# Altium schematic sheet AVR-MEM-CLPD.SchDoc
size A4; Organization: Altium Limited; Address1: L3, 12a Rodborough Rd; Address2: Frenchs Forest; Address3: NSW; Address4: Australia 2086; DocumentName: Farb Borg - ICS
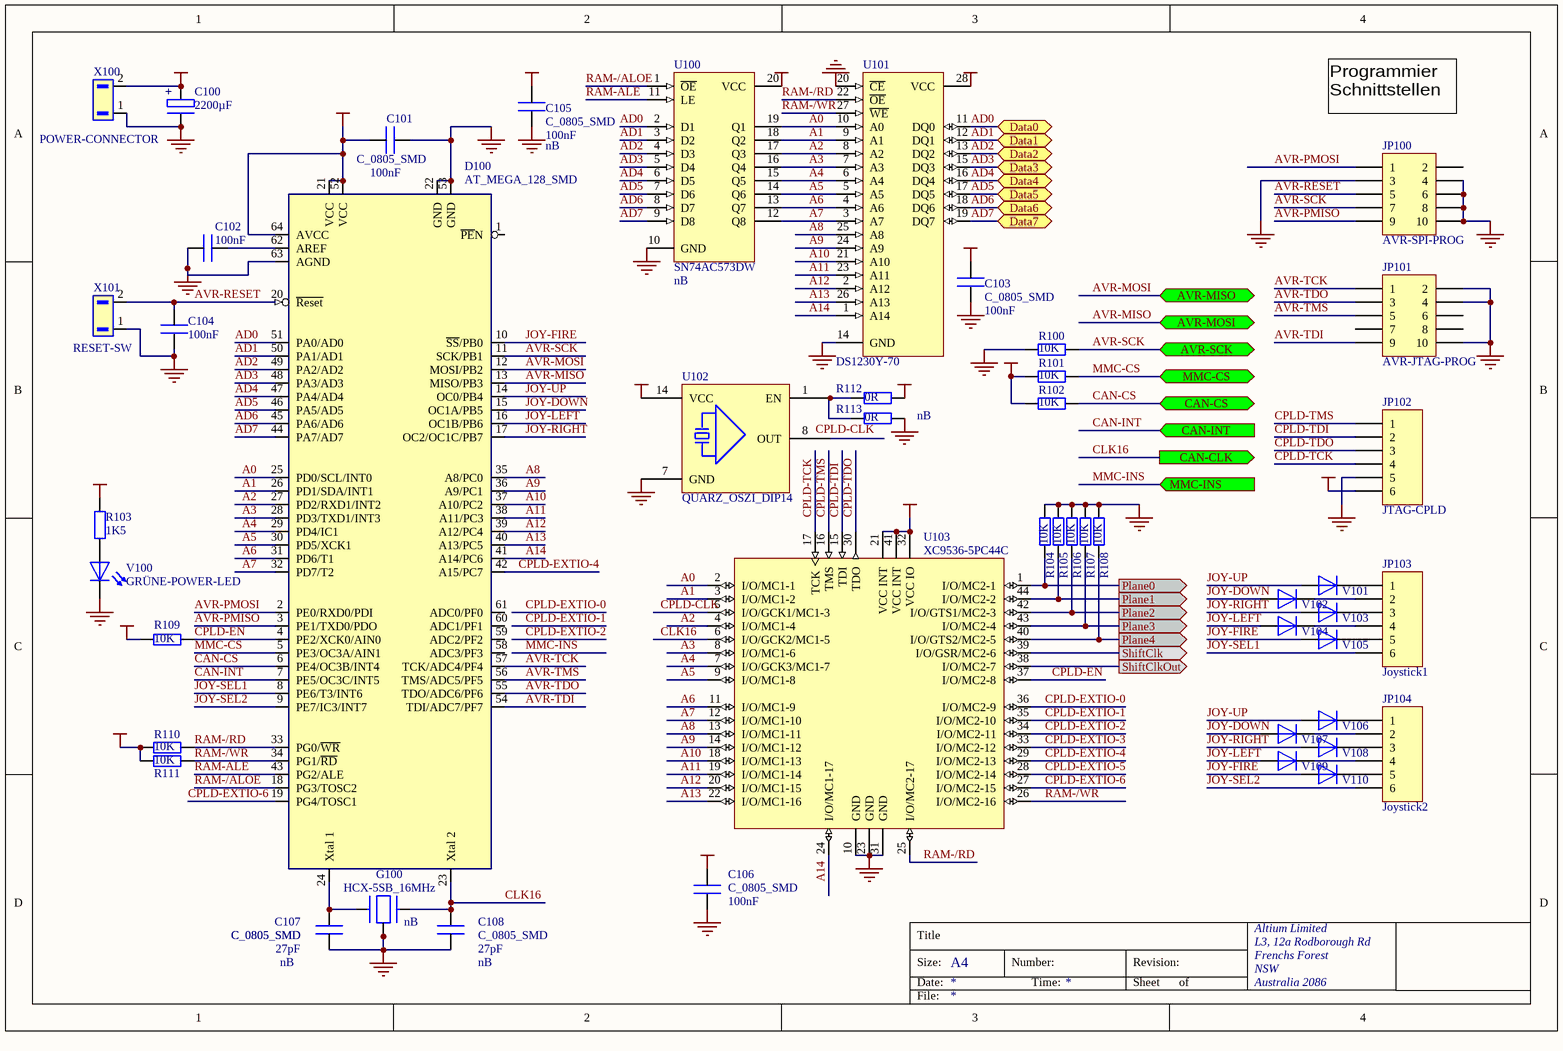
[diagram p0: AVR-MEM-CLPD.SchDoc]

## Parts
C100  C_ELKO_10  [CE_10_21]  (value not drawn)
C101  C_0805_SMD  [0805_R]
C102  C_0805_SMD  [0805_R]  (value not drawn)
C103  C_0805_SMD  [0805_R]
C104  C_0805_SMD  [0805_R]  (value not drawn)
C105  C_0805_SMD  [0805_R]
C106  C_0805_SMD  [0805_R]
C107  C_0805_SMD  [0805_R]
C108  C_0805_SMD  [0805_R]
D100  AT_MEGA_128_SMD  [TQFP64]
G100  HCX-5SB_16MHz  [HCX-5SB_R]
JP100  AVR-SPI-PROG  [HDR2X5]
JP101  AVR-JTAG-PROG  [HDR2X5]
JP102  JTAG-CPLD  [HDR1X6]
JP103  Joystick1  [HDR1X6]
JP104  Joystick2  [HDR1X6]
R100  value 10K  [CR2012-0805]  (hidden comment: PullUp)
R101  value 10K  [CR2012-0805]  (hidden comment: PullUp)
R102  value 10K  [CR2012-0805]  (hidden comment: PullUp)
R103  value 1K5  [CR2012-0805]  (hidden comment: PullUp)
R104  value 10K  [CR2012-0805]  (hidden comment: PullUp)
R105  value 10K  [CR2012-0805]  (hidden comment: PullUp)
R106  value 10K  [CR2012-0805]  (hidden comment: PullUp)
R107  value 10K  [CR2012-0805]  (hidden comment: PullUp)
R108  value 10K  [CR2012-0805]  (hidden comment: PullUp)
R109  value 10K  [CR2012-0805]  (hidden comment: PullUp)
R110  value 10K  [CR2012-0805]  (hidden comment: PullUp)
R111  value 10K  [CR2012-0805]  (hidden comment: PullUp)
R112  value 0R  [CR2012-0805]  (hidden comment: PullUp)
R113  value 0R  [CR2012-0805]  (hidden comment: PullUp)
U100  SN74AC573DW  [DW020]
U101  DS1230Y-70  [ENDIP28A]
U102  QUARZ_OSZI_DIP14  [DIP-14]
U103  XC9536-5PC44C  [PC44]
V100  GRÜNE-POWER-LED  [0805_R]
V101  DIODE_0805_SMD  [0805_R]  (value not drawn)
V102  DIODE_0805_SMD  [0805_R]  (value not drawn)
V103  DIODE_0805_SMD  [0805_R]  (value not drawn)
V104  DIODE_0805_SMD  [0805_R]  (value not drawn)
V105  DIODE_0805_SMD  [0805_R]  (value not drawn)
V106  DIODE_0805_SMD  [0805_R]  (value not drawn)
V107  DIODE_0805_SMD  [0805_R]  (value not drawn)
V108  DIODE_0805_SMD  [0805_R]  (value not drawn)
V109  DIODE_0805_SMD  [0805_R]  (value not drawn)
V110  DIODE_0805_SMD  [0805_R]  (value not drawn)
X100  POWER-CONNECTOR  [STL(Z)1550/2G-3,5-H]
X101  RESET-SW  [STL(Z)1550/2G-3,5-H]

## Ports
AVR-MISO (bidir), AVR-MOSI (bidir), AVR-SCK (bidir), CAN-CLK (out), CAN-CS (bidir), CAN-INT (in), Data0 (bidir), Data1 (bidir), Data2 (bidir), Data3 (bidir), Data4 (bidir), Data5 (bidir), Data6 (bidir), Data7 (bidir), MMC-CS (bidir), MMC-INS (in), Plane0 (out), Plane1 (out), Plane2 (out), Plane3 (out), Plane4 (out), ShiftClk (out), ShiftClkOut (out)

## Nets
GND: C100.2 C101.1 C102.2 C103.1 C104.1 C105.1 C106.1 C107.2 C108.2 D100.22(GND) D100.53(GND) D100.63(AGND) G100.2 G100.4 JP100.3 JP100.4 JP100.6 JP100.8 JP100.10 JP101.2 JP101.4 JP101.10 JP102.5 R100.2 R104.1 R105.1 R106.1 R107.1 R108.1 R113.1 U100.10(GND) U101.14(GND) U101.20(~{CE}) U102.7(GND) U103.10(GND) U103.23(GND) U103.31(GND) V100.2(K) X100.1 X101.1
VCC: C100.1 C101.2 C103.2 C105.2 C106.2 D100.21(VCC) D100.52(VCC) D100.64(AVCC) JP102.6 R101.2 R102.2 R103.1 R109.2 R110.2 R111.2 R112.1 U100.20(VCC) U101.28(VCC) U102.14(VCC) U103.21(VCC_INT) U103.32(VCC_IO) U103.41(VCC_INT) X100.2
A0: D100.25(PD0/SCL/INT0) U100.19(Q1) U101.10(A0) U103.2(I/O/MC1-1)
A1: D100.26(PD1/SDA/INT1) U100.18(Q2) U101.9(A1) U103.3(I/O/MC1-2)
A2: D100.27(PD2/RXD1/INT2) U100.17(Q3) U101.8(A2) U103.4(I/O/MC1-4)
A3: D100.28(PD3/TXD1/INT3) U100.16(Q4) U101.7(A3) U103.8(I/O/MC1-6)
A4: D100.29(PD4/IC1) U100.15(Q5) U101.6(A4) U103.7(I/O/GCK3/MC1-7)
A5: D100.30(PD5/XCK1) U100.14(Q6) U101.5(A5) U103.9(I/O/MC1-8)
A6: D100.31(PD6/T1) U100.13(Q7) U101.4(A6) U103.11(I/O/MC1-9)
A7: D100.32(PD7/T2) U100.12(Q8) U101.3(A7) U103.12(I/O/MC1-10)
A8: D100.35(A8/PC0) U101.25(A8) U103.13(I/O/MC1-11)
A9: D100.36(A9/PC1) U101.24(A9) U103.14(I/O/MC1-12)
A10: D100.37(A10/PC2) U101.21(A10) U103.18(I/O/MC1-13)
A11: D100.38(A11/PC3) U101.23(A11) U103.19(I/O/MC1-14)
A12: D100.39(A12/PC4) U101.2(A12) U103.20(I/O/MC1-15)
A13: D100.40(A13/PC5) U101.26(A13) U103.22(I/O/MC1-16)
A14: D100.41(A14/PC6) U101.1(A14) U103.24(I/O/MC1-17)
AD0: D100.51(PA0/AD0) U100.2(D1) U101.11(DQ0) ; port Data0
AD1: D100.50(PA1/AD1) U100.3(D2) U101.12(DQ1) ; port Data1
AD2: D100.49(PA2/AD2) U100.4(D3) U101.13(DQ2) ; port Data2
AD3: D100.48(PA3/AD3) U100.5(D4) U101.15(DQ3) ; port Data3
AD4: D100.47(PA4/AD4) U100.6(D5) U101.16(DQ4) ; port Data4
AD5: D100.46(PA5/AD5) U100.7(D6) U101.17(DQ5) ; port Data5
AD6: D100.45(PA6/AD6) U100.8(D7) U101.18(DQ6) ; port Data6
AD7: D100.44(PA7/AD7) U100.9(D8) U101.19(DQ7) ; port Data7
AVR-MISO: D100.13(MISO/PB3) ; port AVR-MOSI
AVR-MOSI: D100.12(MOSI/PB2) ; port AVR-MISO
AVR-PMISO: D100.3(PE1/TXD0/PDO) JP100.9
AVR-PMOSI: D100.2(PE0/RXD0/PDI) JP100.1
AVR-RESET: C104.2 D100.20(~{Reset}) JP100.5 X101.2
AVR-SCK: D100.11(SCK/PB1) JP100.7 R100.1 ; port AVR-SCK
AVR-TCK: D100.57(TCK/ADC4/PF4) JP101.1
AVR-TDI: D100.54(TDI/ADC7/PF7) JP101.9
AVR-TDO: D100.55(TDO/ADC6/PF6) JP101.3
AVR-TMS: D100.56(TMS/ADC5/PF5) JP101.5
CAN-CS: D100.6(PE4/OC3B/INT4) R102.1 ; port CAN-CS
CAN-INT: D100.7(PE5/OC3C/INT5) ; port CAN-INT
CLK16: C108.1 D100.23(Xtal_2) G100.3 U103.6(I/O/GCK2/MC1-5) ; port CAN-CLK
CPLD-CLK: U103.5(I/O/GCK1/MC1-3)
CPLD-EN: D100.4(PE2/XCK0/AIN0) R109.1 U103.37(I/O/MC2-8)
CPLD-EXTIO-0: U103.36(I/O/MC2-9)
CPLD-EXTIO-1: U103.35(I/O/MC2-10)
CPLD-EXTIO-2: U103.34(I/O/MC2-11)
CPLD-EXTIO-3: U103.33(I/O/MC2-12)
CPLD-EXTIO-4: D100.42(A15/PC7) U103.29(I/O/MC2-13)
CPLD-EXTIO-5: U103.28(I/O/MC2-14)
CPLD-EXTIO-6: D100.19(PG4/TOSC1) U103.27(I/O/MC2-15)
CPLD-TCK: JP102.4 U103.17(TCK)
CPLD-TDI: JP102.2 U103.15(TDI)
CPLD-TDO: JP102.3 U103.30(TDO)
CPLD-TMS: JP102.1 U103.16(TMS)
JOY-DOWN: D100.15(OC1A/PB5) V102.1(A) V107.1(A)
JOY-FIRE: D100.10(~{SS}/PB0) V105.1(A) V110.1(A)
JOY-LEFT: D100.16(OC1B/PB6) V104.1(A) V109.1(A)
JOY-RIGHT: D100.17(OC2/OC1C/PB7) V103.1(A) V108.1(A)
JOY-SEL1: D100.8(PE6/T3/INT6) JP103.6
JOY-SEL2: D100.9(PE7/IC3/INT7) JP104.6
JOY-UP: D100.14(OC0/PB4) V101.1(A) V106.1(A)
MMC-CS: D100.5(PE3/OC3A/AIN1) R101.1 ; port MMC-CS
MMC-INS: port MMC-INS
Plane0: R104.2 U103.1(I/O/MC2-1) ; port Plane0
Plane1: R105.2 U103.44(I/O/MC2-2) ; port Plane1
Plane2: R106.2 U103.42(I/O/GTS1/MC2-3) ; port Plane2
Plane3: R107.2 U103.43(I/O/MC2-4) ; port Plane3
Plane4: R108.2 U103.40(I/O/GTS2/MC2-5) ; port Plane4
RAM-/ALOE: D100.18(PG3/TOSC2) U100.1(~{OE})
RAM-/RD: D100.33(PG0/~{WR}) R110.1 U101.22(~{OE}) U103.25(I/O/MC2-17)
RAM-/WR: D100.34(PG1/~{RD}) R111.1 U101.27(~{WE}) U103.26(I/O/MC2-16)
RAM-ALE: D100.43(PG2/ALE) U100.11(LE)
ShiftClk: U103.39(I/O/GSR/MC2-6) ; port ShiftClk
ShiftClkOut: U103.38(I/O/MC2-7) ; port ShiftClkOut
NetC102_1: C102.1 D100.62(AREF)
NetC107_1: C107.1 D100.24(Xtal_1) G100.1
NetJP103_1: JP103.1 V101.2(K)
NetJP103_2: JP103.2 V102.2(K)
NetJP103_3: JP103.3 V103.2(K)
NetJP103_4: JP103.4 V104.2(K)
NetJP103_5: JP103.5 V105.2(K)
NetJP104_1: JP104.1 V106.2(K)
NetJP104_2: JP104.2 V107.2(K)
NetJP104_3: JP104.3 V108.2(K)
NetJP104_4: JP104.4 V109.2(K)
NetJP104_5: JP104.5 V110.2(K)
NetR112_2: R112.2 R113.2 U102.1(EN)

Not connected (* = marked no-connect by the designer): D100 1(~{PE}N) 58(ADC3/PF3) 59(ADC2/PF2) 60(ADC1/PF1) 61(ADC0/PF0); JP100 2; JP101 6 7 8; R103 2; U102 8(OUT); V100 1(A)

## Notes on the sheet
- Programmier
  Schnittstellen
- Title
- Size:
- Date:
- A4
- Number:
- Time:
- Revision:
- Sheet
- of
- File:
- Labels drawn without touching a wire or pin: CPLD-CLK
- (in symbol C_0805_SMD) 27pF; nB; 100nF
- (in symbol C_ELKO_10) +; 2200µF
- (in symbol QUARZ_HCX-5SB_16MHz_SMD) nB
- (in symbol Res2) nB
- (in symbol SN74AC573DW) nB

## Library data of the parts
C100 = C_ELKO_10: Kondensator_Elektrolyt_RM10
C101-C108 = C_0805_SMD: Kondensator in SMD-Bauform
D100 = AT_MEGA_128_SMD: ATmega128_SMD_8 Bit Microcontroller with 128k bytes In-System Programmable Flash
G100 = QUARZ_HCX-5SB_16MHz_SMD: Quarz_16MHz_HCX-5SB mit abschirmung_Epson
JP100 JP101 = Header 5X2: Header, 5-Pin, Dual row; Revision: 17-Jul-2002: Re-released for DXP Platform.; Publisher: Altium Limited
JP102-JP104 = Header 6: Header, 6-Pin; Revision: 17-Jul-2002: Re-released for DXP Platform.; Publisher: Altium Limited
R100-R113 = Res2: Resistor; Published: 8-Jun-2000; Revision: July-2002: Re-released for DXP Platform.; Publisher: Altium Limited
U100 = SN74AC573DW: Octal D-Type Transparent Latch with 3-State Outputs; Package Information: Latest Revision: Mar-2000; Code - JEDEC: MS-013; Published: 8-Jun-2000; Revision: 17-Jul-2002: Re-released for DXP Platform.; Datasheet: Latest Revision: Nov-1996; Package Reference: DW020; Publisher: Altium Limited
U101 = DS1230Y-70: 256K Nonvolatile SRAM; Published: 13-Oct-2000; Revision: 17-Jul-2002: PCB footprint, 'DIP-P28/X1.2' replaced; Re-released for DXP Platform.; Datasheet: Latest Revision: 23-Apr-1998; Package Reference: ENDIP28A; Publisher: Altium Limited
U102 = QUARZ-OSZI: Quarz oscilator
U103 = XC9536-5PC44C: XC9500 CPLD with 36 Macrocells, 44-Pin PLCC, Commercial Grade; Revision 1: 17-Jul-2002: Re-released for DXP Platform.; Revision 2: 17-Sep-2003: PCB Footprint dimensions updated; Package Information: Latest Revision: ver1.0, Jun-2000; Code - JEDEC: MS-047; Code - IPC: PLCC-44; Published: 8-Jun-2000; Datasheet: Latest Revision: ver6.1, Aug-2003; Package Reference: PC44; Publisher: Altium Limited
V100 = LED_0805_SMD: Leuchtdiode_SMD_0805
X100 X101 = PTR_STL(Z)1550/2G-3,5-H: Steckerleiste_STL(Z)1550/2G-3,5-H_PTR mit Stecker : AK1550/2-3,5